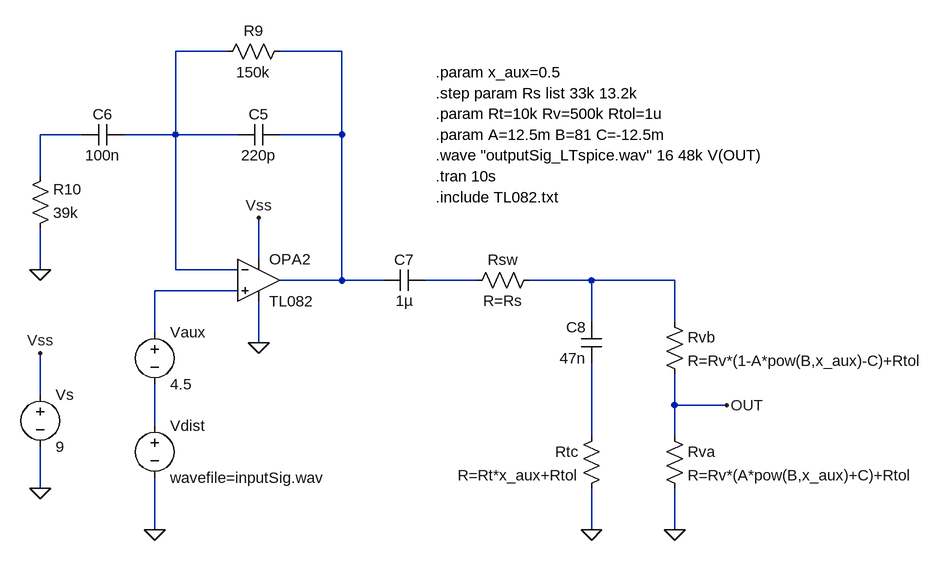
[diagram p0: schematic OCD_ToneControl_Circuit.asc]
OCD_ToneControl_Circuit.asc, the LTspice schematic file:
Version 4
SHEET 1 2324 932
WIRE 944 -64 864 -64
WIRE 1120 -64 1024 -64
WIRE 720 64 656 64
WIRE 864 64 864 -64
WIRE 864 64 784 64
WIRE 960 64 864 64
WIRE 1120 64 1120 -64
WIRE 1120 64 1024 64
WIRE 656 128 656 64
WIRE 992 256 992 192
WIRE 656 272 656 208
WIRE 864 272 864 64
WIRE 960 272 864 272
WIRE 1120 288 1120 64
WIRE 1120 288 1024 288
WIRE 1184 288 1120 288
WIRE 1328 288 1248 288
WIRE 1504 288 1408 288
WIRE 1632 288 1504 288
WIRE 960 304 832 304
WIRE 1504 352 1504 288
WIRE 1632 352 1632 288
WIRE 832 368 832 304
WIRE 992 384 992 320
WIRE 656 464 656 400
WIRE 1632 480 1632 432
WIRE 1712 480 1632 480
WIRE 832 512 832 448
WIRE 1504 528 1504 416
WIRE 1632 528 1632 480
WIRE 656 608 656 544
WIRE 832 672 832 592
WIRE 1504 672 1504 608
WIRE 1632 672 1632 608
FLAG 656 272 0
FLAG 1504 672 0
FLAG 1712 480 OUT
FLAG 832 672 0
FLAG 656 608 0
FLAG 656 400 Vss
FLAG 992 192 Vss
FLAG 992 384 0
FLAG 1632 672 0
SYMBOL cap 1024 48 R90
WINDOW 0 0 32 VBottom 2
WINDOW 3 32 32 VTop 2
SYMATTR InstName C5
SYMATTR Value 220p
SYMBOL res 1040 -80 R90
WINDOW 0 0 56 VBottom 2
WINDOW 3 32 56 VTop 2
SYMATTR InstName R9
SYMATTR Value 150k
SYMBOL cap 784 48 R90
WINDOW 0 0 32 VBottom 2
WINDOW 3 32 32 VTop 2
SYMATTR InstName C6
SYMATTR Value 100n
SYMBOL res 640 224 M180
WINDOW 0 36 76 Left 2
WINDOW 3 36 40 Left 2
SYMATTR InstName R10
SYMATTR Value 39k
SYMBOL cap 1248 272 R90
WINDOW 0 0 32 VBottom 2
WINDOW 3 32 32 VTop 2
SYMATTR InstName C7
SYMATTR Value 1µ
SYMBOL res 1424 272 R90
WINDOW 0 0 56 VBottom 2
WINDOW 3 32 56 VTop 2
SYMATTR InstName Rsw
SYMATTR Value R=Rs
SYMBOL cap 1520 352 M0
SYMATTR InstName C8
SYMATTR Value 47n
SYMBOL voltage 832 496 R0
SYMATTR InstName Vdist
SYMATTR Value wavefile=inputSig.wav
SYMBOL res 1520 512 M0
SYMATTR InstName Rtc
SYMATTR Value R=Rt*x_aux+Rtol
SYMBOL res 1616 336 R0
SYMATTR InstName Rvb
SYMATTR Value R=Rv*(1-A*pow(B,x_aux)-C)+Rtol
SYMBOL res 1616 512 R0
SYMATTR InstName Rva
SYMATTR Value R=Rv*(A*pow(B,x_aux)+C)+Rtol
SYMBOL voltage 656 448 R0
SYMATTR InstName Vs
SYMATTR Value 9
SYMBOL OpAmps\\opamp2 992 224 R0
SYMATTR InstName OPA2
SYMATTR Value TL082
SYMBOL voltage 832 352 R0
SYMATTR InstName Vaux
SYMATTR Value 4.5
TEXT 1264 0 Left 2 !.step param Rs list 33k 13.2k
TEXT 1264 32 Left 2 !.param Rt=10k Rv=500k Rtol=1u
TEXT 1264 96 Left 2 !.wave "outputSig_LTspice.wav" 16 48k V(OUT)
TEXT 1264 128 Left 2 !.tran 10s
TEXT 1264 64 Left 2 !.param A=12.5m B=81 C=-12.5m
TEXT 1264 160 Left 2 !.include TL082.txt
TEXT 1264 -32 Left 2 !.param x_aux=0.5

The netlist it stands for:
* OCD_ToneControl_Circuit.asc
C5 N002 N001 220p
R9 N002 N001 150k
C6 N001 N003 100n
R10 0 N003 39k
C7 N004 N002 1µ
Rsw N005 N004 R=Rs
C8 N005 N008 47n
Vdist N007 0 wavefile=inputSig.wav
Rtc N008 0 R=Rt*x_aux+Rtol
Rvb N005 OUT R=Rv*(1-A*pow(B,x_aux)-C)+Rtol
Rva OUT 0 R=Rv*(A*pow(B,x_aux)+C)+Rtol
Vs Vss 0 9
XOPA2 N006 N001 Vss 0 N002 TL082  ; pins In+ In- V+ V- OUT
Vaux N006 N007 4.5
.step param Rs list 33k 13.2k
.param Rt=10k Rv=500k Rtol=1u
.wave "outputSig_LTspice.wav" 16 48k V(OUT)
.tran 10s
.param A=12.5m B=81 C=-12.5m
.include TL082.txt
.param x_aux=0.5
.backanno
.end